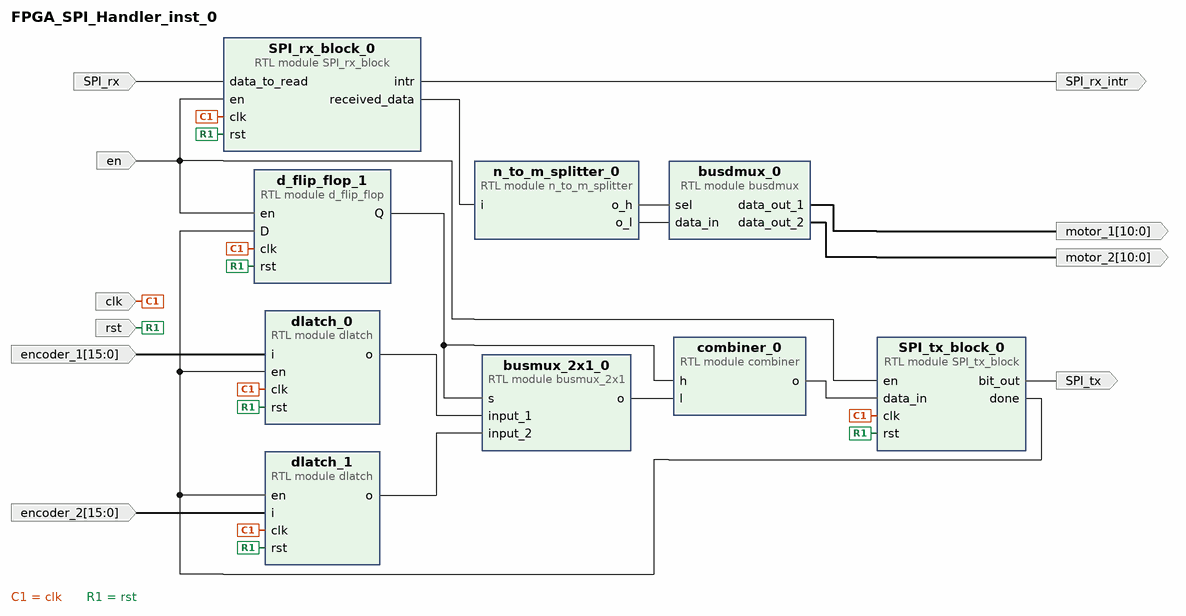
[diagram p0: block diagram of the top level]
# Vivado block design FPGA_SPI_Handler_inst_0, xc7z020clg400-1, Vivado 2024.2
create_bd_design FPGA_SPI_Handler_inst_0

create_bd_port -dir I -type clk clk
create_bd_port -dir I en
create_bd_port -dir O SPI_tx
create_bd_port -dir O -from 10 -to 0 motor_1
create_bd_port -dir O -from 10 -to 0 motor_2
create_bd_port -dir I SPI_rx
create_bd_port -dir I -type rst rst
create_bd_port -dir I -from 15 -to 0 encoder_1
create_bd_port -dir I -from 15 -to 0 encoder_2
create_bd_port -dir O -type intr SPI_rx_intr

create_bd_cell -type module -reference SPI_rx_block SPI_rx_block_0
create_bd_cell -type module -reference busdmux busdmux_0
set_property -dict {CONFIG.BUS_WIDTH 11} [get_bd_cells busdmux_0]
create_bd_cell -type module -reference n_to_m_splitter n_to_m_splitter_0
set_property -dict {CONFIG.input_size 12 CONFIG.output_size_high 1 CONFIG.output_size_low 11} [get_bd_cells n_to_m_splitter_0]
create_bd_cell -type module -reference dlatch dlatch_0
set_property -dict {CONFIG.WIDTH 16} [get_bd_cells dlatch_0]
create_bd_cell -type module -reference dlatch dlatch_1
set_property -dict {CONFIG.WIDTH 16} [get_bd_cells dlatch_1]
create_bd_cell -type module -reference busmux_2x1 busmux_2x1_0
set_property -dict {CONFIG.BIT_WIDTH 16} [get_bd_cells busmux_2x1_0]
create_bd_cell -type module -reference d_flip_flop d_flip_flop_1
create_bd_cell -type module -reference SPI_tx_block SPI_tx_block_0
set_property -dict {CONFIG.BUS_WIDTH 17 CONFIG.dir {"1"}} [get_bd_cells SPI_tx_block_0]
create_bd_cell -type module -reference combiner combiner_0
set_property -dict {CONFIG.lowbits 16} [get_bd_cells combiner_0]

# ---- connections ----

connect_bd_net [get_bd_pins SPI_rx_block_0/intr] [get_bd_ports SPI_rx_intr]
connect_bd_net [get_bd_pins SPI_rx_block_0/received_data] [get_bd_pins n_to_m_splitter_0/i]
connect_bd_net -net SPI_tx_block_2_sent_bit [get_bd_pins SPI_tx_block_0/bit_out] [get_bd_ports SPI_tx]
connect_bd_net [get_bd_pins busdmux_0/data_out_1] [get_bd_ports motor_1]
connect_bd_net [get_bd_pins busdmux_0/data_out_2] [get_bd_ports motor_2]
connect_bd_net [get_bd_pins busmux_2x1_0/o] [get_bd_pins combiner_0/l]
connect_bd_net -net clk_0_1 [get_bd_ports clk] \
  [get_bd_pins SPI_tx_block_0/clk] [get_bd_pins SPI_rx_block_0/clk] [get_bd_pins d_flip_flop_1/clk] \
  [get_bd_pins dlatch_0/clk] [get_bd_pins dlatch_1/clk]
connect_bd_net [get_bd_pins combiner_0/o] [get_bd_pins SPI_tx_block_0/data_in]
connect_bd_net [get_bd_pins d_flip_flop_1/Q] [get_bd_pins busmux_2x1_0/s] [get_bd_pins combiner_0/h]
connect_bd_net -net data_to_read_0_1 [get_bd_ports SPI_rx] [get_bd_pins SPI_rx_block_0/data_to_read]
connect_bd_net [get_bd_pins dlatch_0/o] [get_bd_pins busmux_2x1_0/input_1]
connect_bd_net [get_bd_pins dlatch_1/o] [get_bd_pins busmux_2x1_0/input_2]
connect_bd_net -net en_0_1 [get_bd_ports en] [get_bd_pins SPI_tx_block_0/en] [get_bd_pins SPI_rx_block_0/en] [get_bd_pins d_flip_flop_1/en]
connect_bd_net -net i_0_1 [get_bd_ports encoder_1] [get_bd_pins dlatch_0/i]
connect_bd_net -net i_0_2 [get_bd_ports encoder_2] [get_bd_pins dlatch_1/i]
connect_bd_net [get_bd_pins n_to_m_splitter_0/o_h] [get_bd_pins busdmux_0/sel]
connect_bd_net [get_bd_pins n_to_m_splitter_0/o_l] [get_bd_pins busdmux_0/data_in]
connect_bd_net -net rst_0_1 [get_bd_ports rst] \
  [get_bd_pins SPI_tx_block_0/rst] [get_bd_pins SPI_rx_block_0/rst] [get_bd_pins d_flip_flop_1/rst] \
  [get_bd_pins dlatch_0/rst] [get_bd_pins dlatch_1/rst]
connect_bd_net -net shifting_register_0_done [get_bd_pins SPI_tx_block_0/done] \
  [get_bd_pins d_flip_flop_1/D] [get_bd_pins dlatch_0/en] [get_bd_pins dlatch_1/en]

validate_bd_design
save_bd_design
